# Altium project project_caodinhthi_211410101.PrjPcb
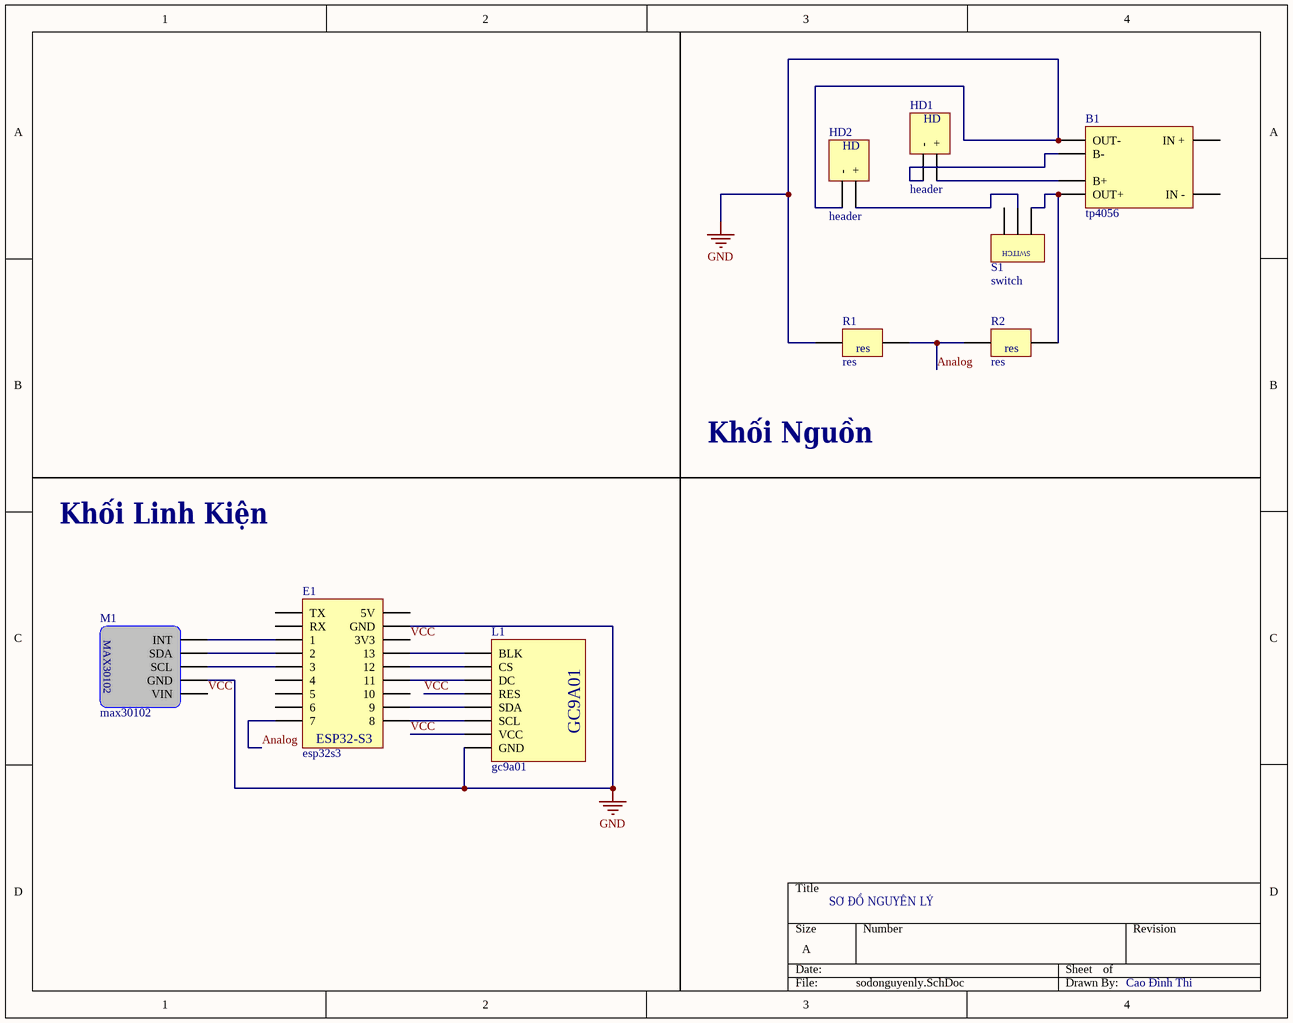
[diagram p0: sodonguyenly.SchDoc]
2 sheets, 17 parts. Net scope: global (net labels, ports and power ports of the same name join across sheets).
Board files: sodomach.PcbDoc, sodomach_end.PcbDoc
Sheets:
  sodonguyenly.SchDoc
  sodonguyenly_end.SchDoc

## Sheet sodonguyenly.SchDoc
size A; SheetNumber: 1; SheetTotal: 2

### Parts
B1  tp4056  [tp4056]
E1  esp32s3  [esp32s3]
HD1  header  [header]
HD2  header  [header]
L1  gc9a01  [gc9a01]
M1  max30102  [max30102]
R1  res  [res]
R2  res  [res]
S1  switch  [switch]

### Nets
GND: B1.2(OUT-) E1.16(GND) HD2.0(-) L1.0(GND) M1.3(GND) R1.0
Analog: E1.8(7) R1.1 R2.0
VCC: E1.15(3V3) L1.1(VCC) L1.4(RES) M1.4(VIN)
NetB1_3: B1.3(B-) HD1.0(-)
NetB1_4: B1.4(B+) HD1.1(+)
NetB1_5: B1.5(OUT+) R2.1 S1.0
NetE1_2: E1.2(1) M1.0(INT)
NetE1_3: E1.3(2) M1.1(SDA)
NetE1_4: E1.4(3) M1.2(SCL)
NetE1_9: E1.9(8) L1.2(SCL)
NetE1_10: E1.10(9) L1.3(SDA)
NetE1_12: E1.12(11) L1.5(DC)
NetE1_13: E1.13(12) L1.6(CS)
NetE1_14: E1.14(13) L1.7(BLK)
NetHD2_1: HD2.1(+) S1.1

Not connected (* = marked no-connect by the designer): B1 0(IN_+) 1(IN_-); E1 0(TX) 1(RX) 5(4) 6(5) 7(6) 11(10) 17(5V); S1 2

### Notes on the sheet
- Khối Nguồn
- Khối Linh Kiện
- SƠ ĐỒ NGUYÊN LÝ
- Cao Đình Thi
- (in symbol esp32s3) ESP32-S3
- (in symbol gc9a01) GC9A01
- (in symbol header) HD
- (in symbol max30102) MAX30102
- (in symbol switch) SWITCH

## Sheet sodonguyenly_end.SchDoc
size A; SheetNumber: 2; SheetTotal: 2
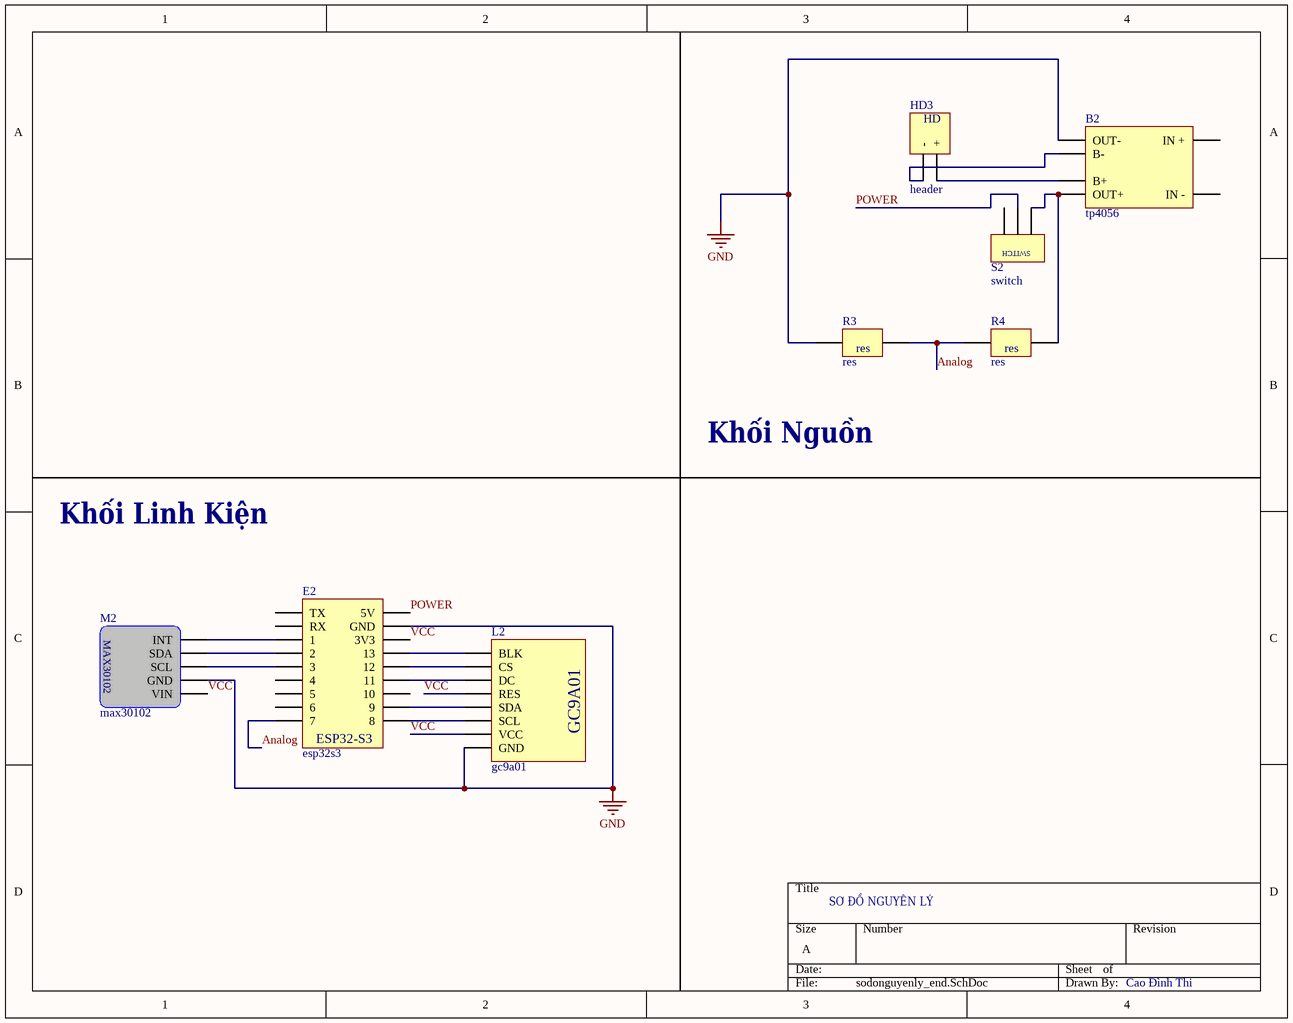
[diagram p1: sodonguyenly_end.SchDoc]

### Parts
B2  tp4056  [tp4056]
E2  esp32s3  [esp32s3]
HD3  header  [header]
L2  gc9a01  [gc9a01]
M2  max30102  [max30102]
R3  res  [res]
R4  res  [res]
S2  switch  [switch]

### Nets
GND: B2.2(OUT-) E2.16(GND) L2.0(GND) M2.3(GND) R3.0
Analog: E2.8(7) R3.1 R4.0
POWER: E2.17(5V) S2.1
VCC: E2.15(3V3) L2.1(VCC) L2.4(RES) M2.4(VIN)
NetB2_3: B2.3(B-) HD3.0(-)
NetB2_4: B2.4(B+) HD3.1(+)
NetB2_5: B2.5(OUT+) R4.1 S2.0
NetE2_2: E2.2(1) M2.0(INT)
NetE2_3: E2.3(2) M2.1(SDA)
NetE2_4: E2.4(3) M2.2(SCL)
NetE2_9: E2.9(8) L2.2(SCL)
NetE2_10: E2.10(9) L2.3(SDA)
NetE2_12: E2.12(11) L2.5(DC)
NetE2_13: E2.13(12) L2.6(CS)
NetE2_14: E2.14(13) L2.7(BLK)

Not connected (* = marked no-connect by the designer): B2 0(IN_+) 1(IN_-); E2 0(TX) 1(RX) 5(4) 6(5) 7(6) 11(10); S2 2

### Notes on the sheet
- Khối Nguồn
- Khối Linh Kiện
- SƠ ĐỒ NGUYÊN LÝ
- Cao Đình Thi
- (in symbol esp32s3) ESP32-S3
- (in symbol gc9a01) GC9A01
- (in symbol header) HD
- (in symbol max30102) MAX30102
- (in symbol switch) SWITCH

## Nets that join several sheets
GND: sodonguyenly (6 pins), sodonguyenly_end (5 pins)
Analog: sodonguyenly (E1.8 R1.1 R2.0), sodonguyenly_end (E2.8 R3.1 R4.0)
VCC: sodonguyenly (E1.15 L1.1 L1.4 M1.4), sodonguyenly_end (E2.15 L2.1 L2.4 M2.4)